# Altium schematic sheet retropi-handheld-board.SchDoc
size A
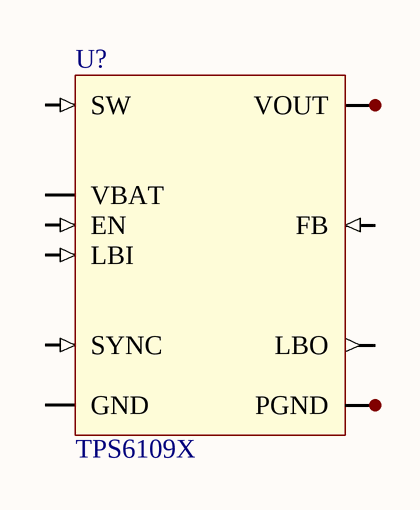
[diagram p0: retropi-handheld-board.SchDoc]

## Parts
U?  TPS6109X  [S-PVQFN-N16]

## Nets
NetU?_1: U?.1(VOUT) U?.15(VOUT) U?.16(VOUT)
NetU?_3: U?.3(SW) U?.4(SW)
NetU?_5: U?.5(PGND) U?.6(PGND) U?.7(PGND) U?.PAD

Not connected (* = marked no-connect by the designer): U? 8(VBAT) 9(LBI) 10(SYNC) 11(EN) 12(LBO) 13(GND) 14(FB)

## Library data of the parts
U? = TPS6109X: element14: 2492460